# Altium schematic sheet radiomic.SchDoc
size A
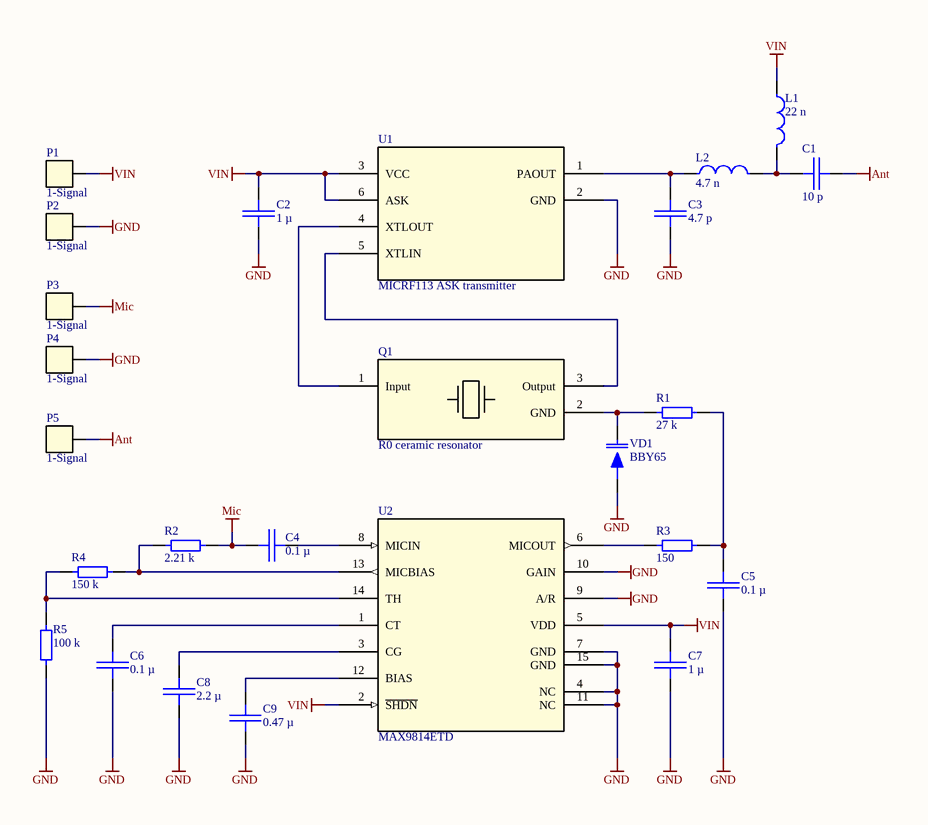
[diagram p0: radiomic.SchDoc]

## Parts
C1  10 p  [0402]
C2  1 µ  [0402]
C3  4.7 p  [0402]
C4  0.1 µ  [0402]
C5  0.1 µ  [0402]
C6  0.1 µ  [0402]
C7  1 µ  [0402]
C8  2.2 µ  [0402]
C9  0.47 µ  [0402]
L1  22 n  [0402]
L2  4.7 n  [0402]
P1  1-Signal  [1-SignalSmall]
P2  1-Signal  [1-SignalSmall]
P3  1-Signal  [1-SignalSmall]
P4  1-Signal  [1-SignalSmall]
P5  1-Signal  [1-SignalSmall]
Q1  R0 ceramic resonator  [R0]
R1  27 k  [0402]
R2  2.21 k  [0402]
R3  150  [0402]
R4  150 k  [0402]
R5  100 k  [0402]
U1  MICRF113 ASK transmitter  [SOT23-6]
U2  MAX9814ETD  [SON40P300X300X80-15N]
VD1  BBY65  [SC79]

## Nets
Ant: C1.2 P5.1
GND: C2.1 C3.1 C5.1 C6.1 C7.1 C8.1 C9.1 P2.1 P4.1 R5.1 U1.2(GND) U2.4(NC) U2.7(GND) U2.9(A/R) U2.10(GAIN) U2.11(NC) U2.15(GND) VD1.1(A)
Mic: C4.2 P3.1 R2.2
VIN: C2.2 C7.2 L1.1 P1.1 U1.3(VCC) U1.6(ASK) U2.2(~{SHDN}) U2.5(VDD)
NetC1_1: C1.1 L1.2 L2.2
NetC3_2: C3.2 L2.1 U1.1(PAOUT)
NetC4_1: C4.1 U2.8(MICIN)
NetC5_2: C5.2 R1.2 R3.2
NetC6_2: C6.2 U2.1(CT)
NetC8_2: C8.2 U2.3(CG)
NetC9_2: C9.2 U2.12(BIAS)
NetQ1_1: Q1.1(Input) U1.4(XTLOUT)
NetQ1_2: Q1.2(GND) R1.1 VD1.2(K)
NetQ1_3: Q1.3(Output) U1.5(XTLIN)
NetR2_1: R2.1 R4.2 U2.13(MICBIAS)
NetR3_1: R3.1 U2.6(MICOUT)
NetR4_1: R4.1 R5.2 U2.14(TH)

## Library data of the parts
C1-C9 = Cap
L1 L2 = Ind
Q1 = R0 resonator
R1-R5 = Res
U1 = MICRF113